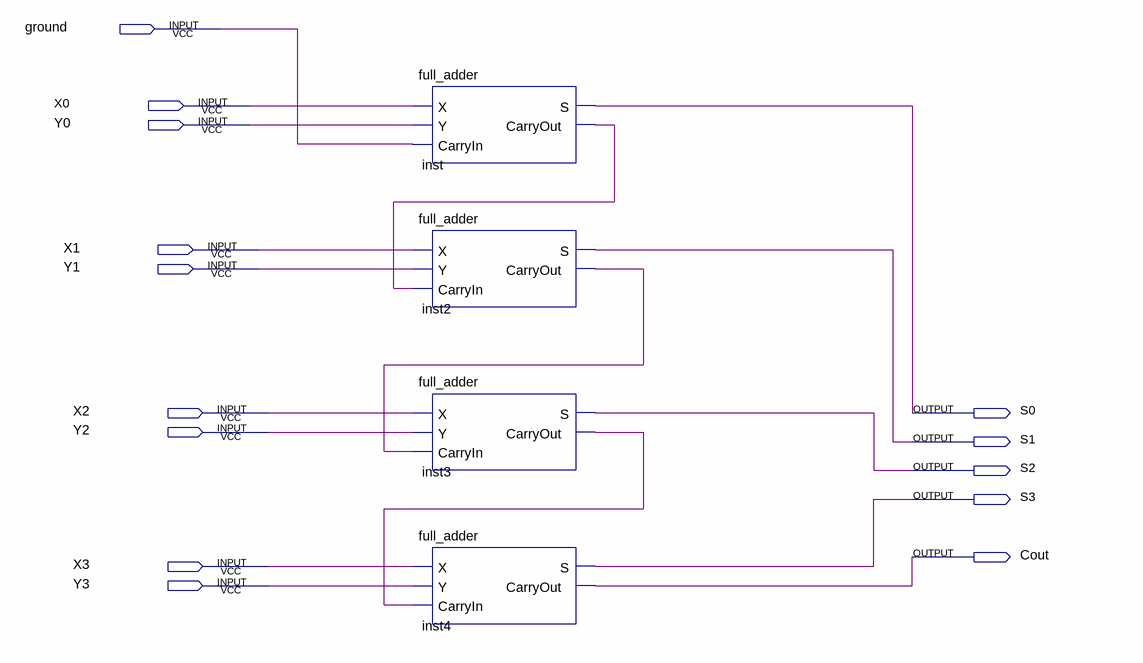
[diagram p0: schematic sheet]
// Quartus schematic four_bits_adder.bdf as structural Verilog: 4 symbols, 14 pins
module four_bits_adder (
  input  ground,
  input  X0,
  input  Y0,
  input  X1,
  input  Y1,
  input  X2,
  input  Y2,
  input  X3,
  input  Y3,
  output S0,
  output S1,
  output S2,
  output S3,
  output Cout
);

  wire inst2_carryout, inst3_carryout, inst_carryout;

  full_adder inst (.X(X0), .Y(Y0), .CarryIn(ground), .S(S0), .CarryOut(inst_carryout));
  full_adder inst2 (.X(X1), .Y(Y1), .CarryIn(inst_carryout), .S(S1), .CarryOut(inst2_carryout));
  full_adder inst3 (.X(X2), .Y(Y2), .CarryIn(inst2_carryout), .S(S2), .CarryOut(inst3_carryout));
  full_adder inst4 (.X(X3), .Y(Y3), .CarryIn(inst3_carryout), .S(S3), .CarryOut(Cout));
endmodule
